# EAGLE board STM32EDUv1p0 (EAGLE 5.10), part 1 of 2
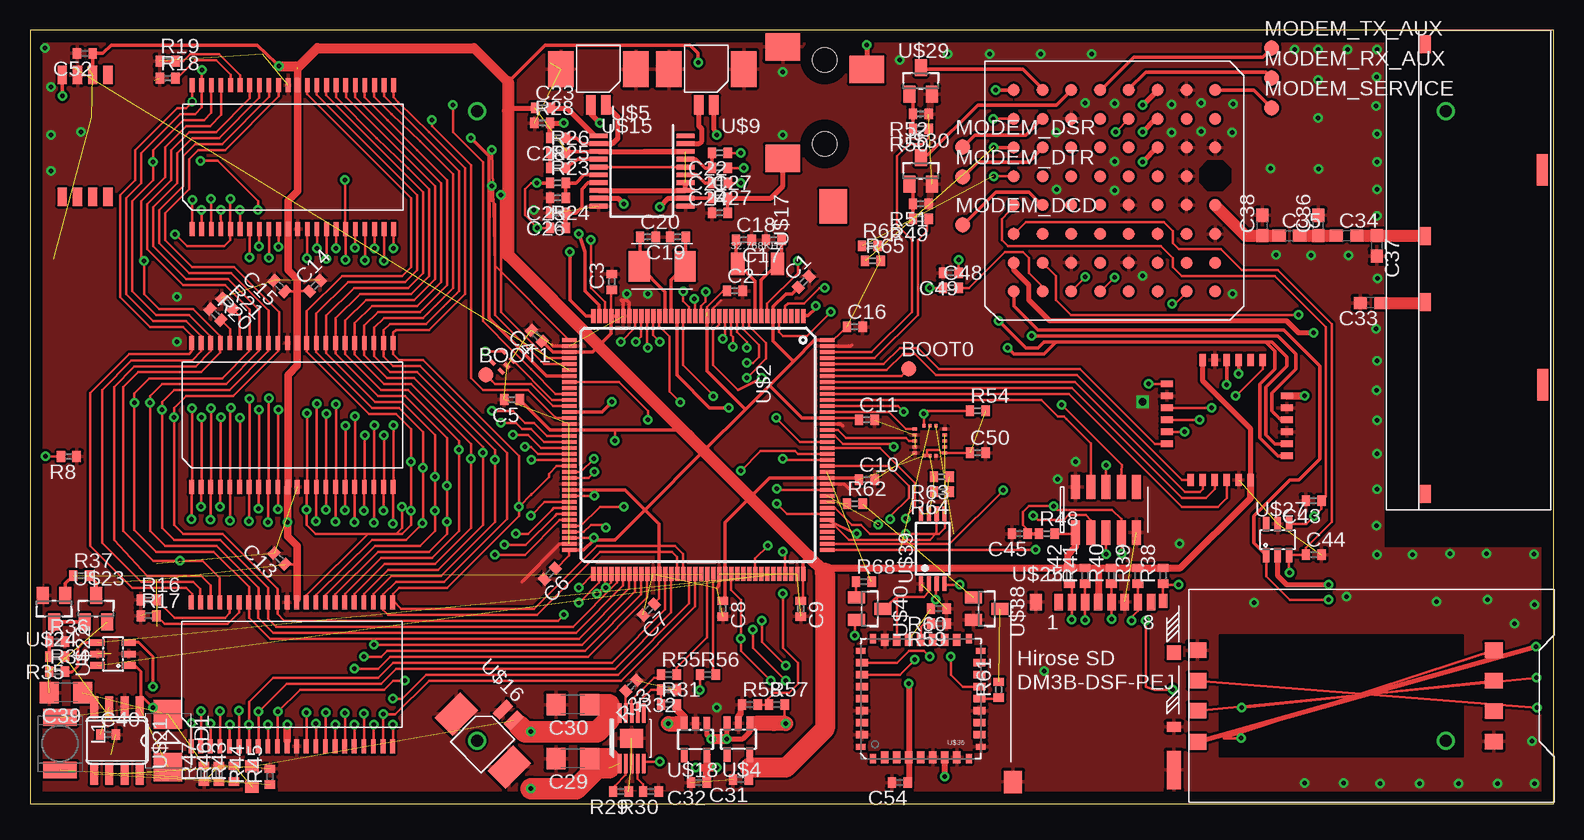
[diagram p4: board, top side]
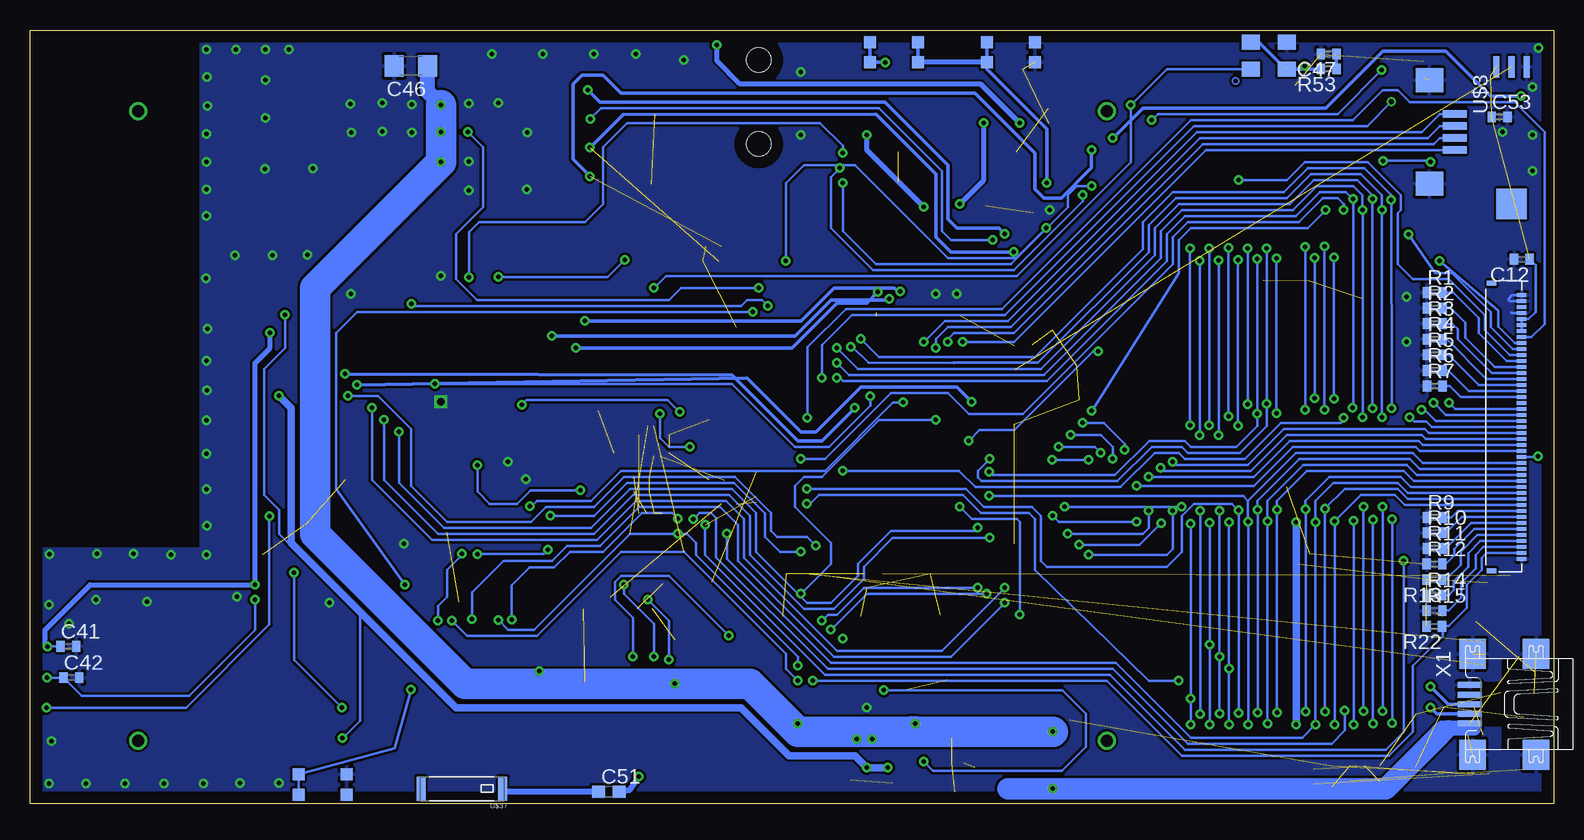
[diagram p5: board, bottom side, seen from below]

Size 127 x 64.5 mm. Coordinates in mm from the lower left corner, seen from the top.
Outline: 0,0 127,0 127,64.5 0,64.5 0,0
Copper layers (1*16): Top 0.035mm / dielectric 1.5mm / Bottom 0.035mm
Design rules "default": minimum track width 10mil, minimum drill 24mil, track to track 8mil, track to pad 8mil, pad to pad 8mil, via to via 8mil, smd to smd 8mil, copper to edge 40mil, drill to drill 8mil, minimum pad ring 10mil, minimum via ring 8mil, stop-mask expansion 4mil, vias tented up to drill 0mil, thermal gap 10mil

## Footprints (pad centres in the part's own frame; a part is rotated, then mirrored left to right if it is on the bottom)
B1,27 = smd 1.27 x 1.27: TP 0,0
C0402 = smd 0.7 x 0.9: 1 -0.65,0; 2 0.65,0
C1206 = smd 1.6 x 1.8: 1 -1.4,0; 2 1.4,0
C0603 = smd 1.1 x 1: 1 -0.85,0; 2 0.85,0
SMB = smd 2.4 x 2.4: A 2.2,0; C -2.2,0
L5038P = smd 1.4 x 2.8: 1 -2.2,0; 2 2.2,0
R0402 = smd 0.7 x 0.9: 1 -0.65,0; 2 0.65,0
R0603 = smd 1 x 1.1: 1 -0.85,0; 2 0.85,0
CM415 = smd 1.1 x 1.9: P$1 0,0; P$2 3.3,0
ABM3 = smd 1.778 x 2.54: P$1 -1.905,0; P$2 1.905,0
TCM8240MD = smd 0.55 x 1: P$1 2,0; P$2 3,0; P$3 4,0; P$4 5,0; P$5 6,0; P$6 7,0; P$13 8,10; P$14 7,10; P$15 6,10; P$16 5,10; P$17 4,10; P$18 3,10 | smd 1 x 0.55: P$7 10,2; P$8 10,3; P$9 10,4; P$10 10,5; P$11 10,6; P$12 10,7; P$19 0,8; P$20 0,7; P$21 0,6; P$22 0,5; P$23 0,4; P$24 0,3
PQFP144 = smd 1.2 x 0.35: 1 -10.75,8.75; 2 -10.75,8.25; 3 -10.75,7.75; 4 -10.75,7.25; 5 -10.75,6.75; 6 -10.75,6.25; 7 -10.75,5.75; 8 -10.75,5.25; 9 -10.75,4.75; 10 -10.75,4.25; 11 -10.75,3.75; 12 -10.75,3.25; 13 -10.75,2.75; 14 -10.75,2.25; 15 -10.75,1.75; 16 -10.75,1.25; 17 -10.75,0.75; 18 -10.75,0.25; 19 -10.75,-0.25; 20 -10.75,-0.75; 21 -10.75,-1.25; 22 -10.75,-1.75; 23 -10.75,-2.25; 24 -10.75,-2.75; 25 -10.75,-3.25; 26 -10.75,-3.75; 27 -10.75,-4.25; 28 -10.75,-4.75; 29 -10.75,-5.25; 30 -10.75,-5.75; 31 -10.75,-6.25; 32 -10.75,-6.75; 33 -10.75,-7.25; 34 -10.75,-7.75; 35 -10.75,-8.25; 36 -10.75,-8.75; 73 10.75,-8.75; 74 10.75,-8.25; 75 10.75,-7.75; 76 10.75,-7.25; 77 10.75,-6.75; 78 10.75,-6.25; 79 10.75,-5.75; 80 10.75,-5.25; 81 10.75,-4.75; 82 10.75,-4.25; 83 10.75,-3.75; 84 10.75,-3.25; 85 10.75,-2.75; 86 10.75,-2.25; 87 10.75,-1.75; 88 10.75,-1.25; 89 10.75,-0.75; 90 10.75,-0.25; 91 10.75,0.25; 92 10.75,0.75; 93 10.75,1.25; 94 10.75,1.75; 95 10.75,2.25; 96 10.75,2.75; 97 10.75,3.25; 98 10.75,3.75; 99 10.75,4.25; 100 10.75,4.75; 101 10.75,5.25; 102 10.75,5.75; 103 10.75,6.25; 104 10.75,6.75; 105 10.75,7.25; 106 10.75,7.75; 107 10.75,8.25; 108 10.75,8.75 | smd 0.35 x 1.2: 37 -8.75,-10.75; 38 -8.25,-10.75; 39 -7.75,-10.75; 40 -7.25,-10.75; 41 -6.75,-10.75; 42 -6.25,-10.75; 43 -5.75,-10.75; 44 -5.25,-10.75; 45 -4.75,-10.75; 46 -4.25,-10.75; 47 -3.75,-10.75; 48 -3.25,-10.75; 49 -2.75,-10.75; 50 -2.25,-10.75; 51 -1.75,-10.75; 52 -1.25,-10.75; 53 -0.75,-10.75; 54 -0.25,-10.75; 55 0.25,-10.75; 56 0.75,-10.75; 57 1.25,-10.75; 58 1.75,-10.75; 59 2.25,-10.75; 60 2.75,-10.75; 61 3.25,-10.75; 62 3.75,-10.75; 63 4.25,-10.75; 64 4.75,-10.75; 65 5.25,-10.75; 66 5.75,-10.75; 67 6.25,-10.75; 68 6.75,-10.75; 69 7.25,-10.75; 70 7.75,-10.75; 71 8.25,-10.75; 72 8.75,-10.75; 109 8.75,10.75; 110 8.25,10.75; 111 7.75,10.75; 112 7.25,10.75; 113 6.75,10.75; 114 6.25,10.75; 115 5.75,10.75; 116 5.25,10.75; 117 4.75,10.75; 118 4.25,10.75; 119 3.75,10.75; 120 3.25,10.75; 121 2.75,10.75; 122 2.25,10.75; 123 1.75,10.75; 124 1.25,10.75; 125 0.75,10.75; 126 0.25,10.75; 127 -0.25,10.75; 128 -0.75,10.75; 129 -1.25,10.75; 130 -1.75,10.75; 131 -2.25,10.75; 132 -2.75,10.75; 133 -3.25,10.75; 134 -3.75,10.75; 135 -4.25,10.75; 136 -4.75,10.75; 137 -5.25,10.75; 138 -5.75,10.75; 139 -6.25,10.75; 140 -6.75,10.75; 141 -7.25,10.75; 142 -7.75,10.75; 143 -8.25,10.75; 144 -8.75,10.75
MOLEX-1.0-FPC-RA-CONN-4POS = smd 0.6 x 2: P$1 0,1; P$2 1,1; P$3 2,1; P$4 3,1 | smd 2 x 2.3: P$5 -2.8,-1.1; P$6 5.8,-1.1
SOT23-5L = smd 0.55 x 1.2: 1 -0.95,-1.3; 2 0,-1.3; 3 0.95,-1.3; 4 0.95,1.3; 5 -0.95,1.3
SSOP20 = smd 0.4 x 1.5: 1 -2.925,-3.625; 2 -2.275,-3.625; 3 -1.625,-3.625; 4 -0.975,-3.625; 5 -0.325,-3.625; 6 0.325,-3.625; 7 0.975,-3.625; 8 1.625,-3.625; 9 2.275,-3.625; 10 2.925,-3.625; 11 2.925,3.625; 12 2.275,3.625; 13 1.625,3.625; 14 0.975,3.625; 15 0.325,3.625; 16 -0.325,3.625; 17 -0.975,3.625; 18 -1.625,3.625; 19 -2.275,3.625; 20 -2.925,3.625
R-PDSO-G10 = smd 0.3 x 1.6: P$1 0,0; P$2 0.5,0; P$3 1,0; P$4 1.5,0; P$5 2,0; P$6 2,4.2; P$7 1.5,4.2; P$8 1,4.2; P$9 0.5,4.2; P$10 0,4.2 | smd 1.9 x 1.6: P$11 1,2.1
SWITCH_KMS = smd 1 x 1: P$1 0,0; P$2 4,0; P$3 4,1.7; P$4 0,1.7
MOLEX-1.25WTB-RA-CONN = smd 0.8 x 1.6: P$1 0,0; P$2 1.25,0 | smd 2.1 x 3: P$3 -2.5,-3; P$4 3.75,-3
STM32-JTAG-10P = smd 0.762 x 2.032: P$1 0,0; P$2 0,3.81; P$3 1.27,0; P$4 1.27,3.81; P$5 2.54,0; P$6 2.54,3.81; P$7 3.81,0; P$8 3.81,3.81; P$9 5.08,0; P$10 5.08,3.81
HIROSE-FFC-FH19SC-45 = smd 0.3 x 0.8: P1 -11,0; P2 -10.5,0; P3 -10,0; P4 -9.5,0; P5 -9,0; P6 -8.5,0; P7 -8,0; P8 -7.5,0; P9 -7,0; P10 -6.5,0; P11 -6,0; P12 -5.5,0; P13 -5,0; P14 -4.5,0; P15 -4,0; P16 -3.5,0; P17 -3,0; P18 -2.5,0; P19 -2,0; P20 -1.5,0; P21 -1,0; P22 -0.5,0; P23 0,0; P24 0.5,0; P25 1,0; P26 1.5,0; P27 2,0; P28 2.5,0; P29 3,0; P30 3.5,0; P31 4,0; P32 4.5,0; P33 5,0; P34 5.5,0; P35 6,0; P36 6.5,0; P37 7,0; P38 7.5,0; P39 8,0; P40 8.5,0; P41 9,0; P42 9.5,0; P43 10,0; P44 10.5,0; P45 11,0 | smd 0.4 x 0.8: P$46 -12,-2.5; P$47 12,-2.5
TSOPII-44 = smd 0.4 x 1.2: 1 0,0; 2 0.8,0; 3 1.6,0; 4 2.4,0; 5 3.2,0; 6 4,0; 7 4.8,0; 8 5.6,0; 9 6.4,0; 10 7.2,0; 11 8,0; 12 8.8,0; 13 9.6,0; 14 10.4,0; 15 11.2,0; 16 12,0; 17 12.8,0; 18 13.6,0; 19 14.4,0; 20 15.2,0; 21 16,0; 22 16.8,0; 23 16.8,12; 24 16,12; 25 15.2,12; 26 14.4,12; 27 13.6,12; 28 12.8,12; 29 12,12; 30 11.2,12; 31 10.4,12; 32 9.6,12; 33 8.8,12; 34 8,12; 35 7.2,12; 36 6.4,12; 37 5.6,12; 38 4.8,12; 39 4,12; 40 3.2,12; 41 2.4,12; 42 1.6,12; 43 0.8,12; 44 0,12
KOBICONN-161-403X-E-TOP = smd 2.3 x 2.9: P$1 -2.4,3.5; P$2 -11.7,3.5; P$4 -4.3,-3.5 | smd 2.9 x 2.3: P$3 -15.7,-0.7 | hole 2: -3.5,0; -10.5,0
TELIT-GE865 = smd 1 x 1: A1 0,0; A2 0,-2.4; A3 0,-4.8; A4 0,-7.2; A5 0,-9.6; A6 0,-12; A7 0,-14.4; A8 0,-16.8; B1 2.4,0; B2 2.4,-2.4; B3 2.4,-4.8; B4 2.4,-7.2; B5 2.4,-9.6; B6 2.4,-12; B7 2.4,-14.4; B8 2.4,-16.8; C1 4.8,0; C2 4.8,-2.4; C3 4.8,-4.8; C4 4.8,-7.2; C5 4.8,-9.6; C6 4.8,-12; C7 4.8,-14.4; C8 4.8,-16.8; D1 7.2,0; D2 7.2,-2.4; D3 7.2,-4.8; D4 7.2,-7.2; D5 7.2,-9.6; D6 7.2,-12; D7 7.2,-14.4; D8 7.2,-16.8; E1 9.6,0; E2 9.6,-2.4; E3 9.6,-4.8; E4 9.6,-7.2; E5 9.6,-9.6; E6 9.6,-12; E7 9.6,-14.4; E8 9.6,-16.8; F1 12,0; F2 12,-2.4; F3 12,-4.8; F4 12,-7.2; F5 12,-9.6; F6 12,-12; F7 12,-14.4; F8 12,-16.8; G1 14.4,0; G2 14.4,-2.4; G3 14.4,-4.8; G4 14.4,-7.2; G5 14.4,-9.6; G6 14.4,-12; G7 14.4,-14.4; G8 14.4,-16.8; H1 16.8,0; H2 16.8,-2.4; H3 16.8,-4.8; H5 16.8,-9.6; H6 16.8,-12; H7 16.8,-14.4; H8 16.8,-16.8
CCM03-300X = smd 1.5 x 1.3: C1 24.7,5.1; C2 24.7,2.5; C3 24.7,0; C5 0,5.08; C6 0,2.54; C7 0,0; P$1 0,-2.54; P$2 24.705,-2.54
SO08 = smd 0.66 x 1.8: 1 -1.905,-2.773; 2 -0.635,-2.773; 3 0.635,-2.773; 4 1.905,-2.773; 5 1.905,2.773; 6 0.635,2.773; 7 -0.635,2.773; 8 -1.905,2.773
SOT23-6L = smd 0.55 x 1.2: 1 -0.95,-1.3; 2 0,-1.3; 3 0.95,-1.3; 4 0.95,1.3; 5 0,1.3; 6 -0.95,1.3
SOT23 = smd 1 x 1.4: 1 -0.95,-1.1; 2 0.95,-1.1; 3 0,1.1
HIROSE-SDCARD-DM3B-DSF-PEJ = smd 0.7 x 1.4: P$1 0,-0.7; P$2 1.1,-0.7; P$3 2.2,-0.7; P$4 3.3,-0.7; P$5 4.4,-0.7; P$6 5.5,-0.7; P$7 6.6,-0.7; P$8 7.7,-0.7 | smd 0.7 x 1.2: P$9 8.7,-0.6 | smd 1.2 x 1.2: P$10 9.6,-4.9 | smd 1.2 x 0.8: P$11 9.6,-11.1 | smd 1.2 x 3.2: P$12 9.6,-14.7 | smd 1.5 x 1.9: P$13 -3.8,-15.7 | smd 1 x 1.4: P$14 -1.9,-0.7
REFLEXUS-A10315 = smd 1.5 x 1: P$1 17.2,-0.5; P$2 22.7,-0.5; P$3 1.2,-0.5; P$4 38.7,-0.5 | smd 2.6 x 0.9: P$5 11.66,9.32; P$6 29.58,9.35
SP0408HE5H-BOT = smd 1.25 x 1.5 bottom: P$1 2.25,3; P$2 2.25,0; P$3 0,0; P$4 0,3
LIS331DLH = smd 0.4 x 0.25: P$1 -1.25,1; P$2 -1.25,0.5; P$3 -1.25,0; P$4 -1.25,-0.5; P$5 -1.25,-1; P$9 1.25,-1; P$10 1.25,-0.5; P$11 1.25,0; P$12 1.25,0.5; P$13 1.25,1 | smd 0.25 x 0.33: P$6 -0.5,-1.25; P$7 0,-1.25; P$8 0.5,-1.25; P$14 0.5,1.25; P$15 0,1.25; P$16 -0.5,1.25
SC-70-5 = smd 0.3 x 0.6: P$1 -0.65,0; P$2 0,0; P$3 0.65,0; P$4 0.65,1.056; P$5 -0.65,1.056
HIH-5030 = smd 2.54 x 2.54: P$1 0,0 | smd 0.508 x 1.778: P$2 -1.27,-11.43; P$3 0,-11.43; P$4 1.27,-11.43
SSOP8 = smd 1.524 x 0.762: P$1 0,0; P$2 0,-1.27; P$3 0,-2.54; P$4 0,-3.81; P$5 10.16,-3.81; P$6 10.16,-2.54; P$7 10.16,-1.27; P$8 10.16,0
GR-10 = smd 0.8 x 0.5: 1 5,4; 9 5,-4; 19 -5,-4; 27 -5,4 | smd 1 x 0.6: 2 4.9,3; 3 4.9,2; 4 4.9,1; 5 4.9,0; 6 4.9,-1; 7 4.9,-2; 8 4.9,-3; 20 -4.9,-3; 21 -4.9,-2; 22 -4.9,-1; 23 -4.9,0; 24 -4.9,1; 25 -4.9,2; 26 -4.9,3 | smd 0.5 x 0.8: 10 4,-5; 18 -4,-5; 28 -4,5; 36 4,5 | smd 0.6 x 1: 11 3,-4.9; 12 2,-4.9; 13 1,-4.9; 14 0,-4.9; 15 -1,-4.9; 16 -2,-4.9; 17 -3,-4.9; 29 -3,4.9; 30 -2,4.9; 31 -1,4.9; 32 0,4.9; 33 1,4.9; 34 2,4.9; 35 3,4.9
ANTENNA-CHIP6 = smd 0.75 x 2: 1 -3.4,0; NC 3.4,0
TSSOP8 = smd 1.2 x 0.35: 1 -2.925,0.975; 2 -2.925,0.325; 3 -2.925,-0.325; 4 -2.925,-0.975; 5 2.925,-0.975; 6 2.925,-0.325; 7 2.925,0.325; 8 2.925,0.975
UX60A-MB-5ST = smd 2 x 0.5: 1 2.25,1.6; 2 2.25,0.8; 3 2.25,0; 4 2.25,-0.8; 5 2.25,-1.6 | smd 2.2 x 2.5: M1 -3.3,-4.2; M2 -3.3,4.2; M3 2,4.2; M4 2,-4.2

## Placement (x,y rotation side)
BOOT0  TPB1,27  [B1,27]  73.25,36.25 0 top
BOOT1  TPB1,27  [B1,27]  38,35.75 0 top
C1  [C0402]  64.5,43.5 45 top
C2  [C0402]  58.75,42.75 0 top
C3  [C0402]  48.5,43.5 90 top
C4  [C0402]  42.25,39 135 top
C5  [C0402]  40.18,33.68 180 top
C6  [C0402]  43.32,19.18 225 top
C7  [C0402]  51.57,16.18 225 top
C8  [C0402]  57.75,16.25 270 top
C9  [C0402]  64.25,16.25 270 top
C10  [C0402]  69.75,27 0 top
C11  [C0402]  69.75,32 0 top
C12  0.1uF  [C0402]  2.64,45.39 180 bottom
C13  0.1uF  [C0402]  20.8,20.41 135 top
C14  0.1uF  [C0402]  23.74,43.17 45 top
C15  0.1uF  [C0402]  20.8,43.15 135 top
C16  [C0402]  68.75,39.75 0 top
C17  9pF  [C0402]  62,47 180 top
C18  9pF  [C0402]  59.5,47 0 top
C19  18pF  [C0402]  54,47.25 180 top
C20  18pF  [C0402]  51.5,47.25 0 top
C21  0.33uF  [C0402]  57.5,53 180 top
C22  0.33uF  [C0402]  57.5,54.25 180 top
C23  0.1uF  [C0402]  42.75,58 0 top
C24  0.33uF  [C0402]  57.5,51.75 180 top
C25  [C0402]  44,50.5 180 top
C26  [C0402]  44,49.25 180 top
C27  [C0402]  57.5,50.5 0 top
C28  [C0402]  44,55.5 180 top
C29  [C1206]  45.25,3.75 180 top
C30  [C1206]  45.25,8.25 180 top
C31  [C0402]  59.25,2 180 top
C32  [C0402]  55.75,1.75 180 top
C33  [C0603]  111.75,41.75 180 top
C34  [C0603]  109.75,47.35 0 top
C35  [C0603]  104.97,47.35 0 top
C36  [C0603]  107.4,48.2 90 top
C37  [C0603]  112.25,46.5 270 top
C38  [C0603]  102.72,48.2 90 top
C39  [C1206]  3,9.25 180 top
C40  680pF  [C0402]  6.5,5.75 0 top
C41  [C0402]  123.8,13.1 0 bottom
C42  [C0402]  123.55,10.5 0 bottom
C43  [C0402]  107,25.25 180 top
C44  [C0402]  107,20.75 0 top
C45  220pF  [C0402]  82.5,22.5 180 top
C46  22uF  [C1206]  95.25,61.5 180 bottom
C47  0.47uF  [C0402]  18.75,62.5 180 bottom
C48  0.1uF  [C0402]  76.75,43 0 top
C49  0.1uF  [C0402]  76.75,44.25 180 top
C50  0.1uF  [C0402]  79,29.25 0 top
C51  0.033uF  [C0603]  78.75,1 0 bottom
C52  0.1uF  [C0402]  4.58,62.55 180 top
C53  0.1uF  [C0402]  4.5,57.25 0 bottom
C54  0.1uF  [C0402]  72.5,1.75 180 top
D1  MBRS130LT3  [SMB]  11.5,5.25 270 top
L1  120uH  [L5038P]  2.5,5 270 top
MODEM_DCD  TPB1,27  [B1,27]  77.75,48.25 0 top
MODEM_DSR  TPB1,27  [B1,27]  77.75,54.75 0 top
MODEM_DTR  TPB1,27  [B1,27]  77.75,52.25 0 top
MODEM_RX_AUX  TPB1,27  [B1,27]  103.5,60.5 0 top
MODEM_SERVICE  TPB1,27  [B1,27]  103.5,58 0 top
MODEM_TX_AUX  TPB1,27  [B1,27]  103.5,63 0 top
R1  10K  [R0402]  9.9,42.61 0 bottom
R2  10K  [R0402]  9.9,41.31 0 bottom
R3  10K  [R0402]  9.89,40.01 0 bottom
R4  10K  [R0402]  9.89,38.71 0 bottom
R5  10K  [R0402]  9.91,37.41 0 bottom
R6  10K  [R0402]  9.9,36.11 0 bottom
R7  10K  [R0402]  9.9,34.81 0 bottom
R8  10K  [R0402]  3.23,28.94 180 top
R9  10K  [R0402]  9.89,23.86 0 bottom
R10  10K  [R0402]  9.91,22.58 0 bottom
R11  10K  [R0402]  9.91,21.28 0 bottom
R12  [R0402]  9.93,19.97 0 bottom
R13  10K  [R0402]  9.92,18.67 180 bottom
R14  10K  [R0402]  9.93,17.38 0 bottom
R15  10K  [R0402]  9.92,16.08 0 bottom
R16  10K  [R0402]  9.89,16.98 0 top
R17  10K  [R0402]  9.88,15.66 0 top
R18  10K  [R0402]  11.48,60.48 0 top
R19  10K  [R0402]  11.47,61.91 0 top
R20  10K  [R0402]  15.46,40.77 315 top
R21  10K  [R0402]  16.45,41.68 315 top
R22  10K  [R0402]  9.95,14.77 180 bottom
R23  2.2K  [R0402]  44,51.75 0 top
R24  2.2K  [R0402]  44,48 0 top
R25  100K  [R0402]  44,53 0 top
R26  820K  [R0402]  44,54.25 0 top
R27  [R0402]  57.5,49.25 0 top
R28  [R0402]  42.7,56.75 0 top
R29  1K  [R0402]  49.25,1 180 top
R30  1K  [R0402]  51.75,1 180 top
R31  [R0402]  53.25,8.25 0 top
R32  [R0402]  53.25,9.5 180 top
R33  [R0402]  50.12,9.83 225 top
R34  1.5K  [R0402]  2.25,11 0 top
R35  10K  [R0402]  2.25,12.25 180 top
R36  36K  [R0402]  2.25,13.5 0 top
R37  47K  [R0402]  4.25,19 0 top
R38  [R0402]  94.45,19 90 top
R39  [R0402]  92.35,19 90 top
R40  [R0402]  90.15,19 90 top
R41  [R0402]  87.95,19 90 top
R42  [R0402]  86.65,19 90 top
R43  180  [R0402]  17,2.5 90 top
R44  0.24  [R0603]  18.5,2.25 90 top
R45  [R0402]  20,2.25 90 top
R46  2.2K  [R0402]  15.75,2.5 90 top
R47  33.8K  [R0402]  14.5,2.5 90 top
R48  100K  [R0402]  84.75,22.5 0 top
R49  10K  [R0402]  74.25,48.75 180 top
R50  10K  [R0402]  74.25,56.25 180 top
R51  47K  [R0402]  74.25,50 180 top
R52  47K  [R0402]  74.25,57.5 180 top
R53  0  [R0402]  18.75,61.25 180 bottom
R54  47K  [R0402]  79,32.75 0 top
R55  330  [R0402]  53.25,10.75 0 top
R56  330  [R0402]  56.5,10.75 0 top
R57  [R0402]  62.25,8.25 0 top
R58  [R0402]  60,8.25 0 top
R59  47K  [R0402]  75.75,15 180 top
R60  47K  [R0402]  75.75,16.25 180 top
R61  10K  [R0402]  80.75,9.5 90 top
R62  10K  [R0402]  68.75,25 0 top
R63  [R0402]  76,27.25 180 top
R64  [R0402]  76,26 180 top
R65  [R0402]  70.25,45.25 0 top
R66  [R0402]  70,46.5 0 top
R68  [R0402]  69.5,18.5 0 top
U3  CM415  [CM415]  59,45 0 top
U5  CRYSTAL-ABM3  [ABM3]  52.7,44.8 180 top
U$1  TCM8240MD  [TCM8240MD]  94.75,27 0 top
U$2  STM32F103XE  [PQFP144]  55.7,29.9 270 top
U$3  MOLEX-1.0-FPC-RA-CONN-4POS  [MOLEX-1.0-FPC-RA-CONN-4POS]  9.25,57.5 270 bottom
U$4  NCP500  [SOT23-5L]  59.05,5.37 180 top
U$5  TDA8552TS  [SSOP20]  51,52.75 270 top
U$6  BQ24090  [R-PDSO-G10]  49.15,3.34 0 top
U$7  SWITCH-KSC  [SWITCH_KMS]  43.25,63.5 180 bottom
U$8  SWITCH-KSC  [SWITCH_KMS]  53,63.5 180 bottom
U$9  MOLEX-1.25-WTB-RA-CONN-2POS  [MOLEX-1.25WTB-RA-CONN]  57,58.25 180 top
U$10  STM32-JTAG-10P  [STM32-JTAG-10P]  87.16,22.59 0 top
U$11  DISPLAYTECH-SDT033TFTH  [HIROSE-FFC-FH19SC-45]  2.66,31.4 270 bottom
U$12  CY62157EV30LL-55ZSXE  [TSOPII-44]  13.43,4.77 0 top
U$13  CY62157EV30LL-55ZSXE  [TSOPII-44]  13.52,47.9 0 top
U$14  CY62157EV30LL-55ZSXE  [TSOPII-44]  13.47,26.4 0 top
U$15  MOLEX-1.25-WTB-RA-CONN-2POS  [MOLEX-1.25WTB-RA-CONN]  48,58.25 180 top
U$16  MOLEX-1.25-WTB-RA-CONN-2POS  [MOLEX-1.25WTB-RA-CONN]  39.43,7.82 315 top
U$17  KOBICONN-161-4034-E-TOP  [KOBICONN-161-403X-E-TOP]  66.25,65.5 90 top
U$18  NCP500  [SOT23-5L]  55.48,5.35 180 top
U$19  TELIT-GE865T  [TELIT-GE865]  82,59.5 0 top
U$20  CCM03-3009  [CCM03-300X]  122,10.25 180 top
U$21  DIODESINC-AP34063  [SO08]  7.25,5.25 180 top
U$22  USBLC6-2  [SOT23-6L]  6.93,12.47 90 top
U$23  PMBT6428  [SOT23]  5.5,16.25 0 top
U$24  PMBT6428  [SOT23]  2,16.25 180 top
U$25  HIROSE-SDCARD-DM3B-DSF-PEJ  [HIROSE-SDCARD-DM3B-DSF-PEJ]  85.75,17.5 0 top
U$26  REFLEXUS-A10315  [REFLEXUS-A10315]  116.75,64.5 270 top
U$27  DALC208  [SOT23-6L]  104,22 0 top
U$28  SPM0408HE5H  [SP0408HE5H-BOT]  22.25,63.5 270 top
U$29  PMBT6428  [SOT23]  74.25,60.25 0 top
U$30  PMBT6428  [SOT23]  74.25,52.75 0 top
U$31  SWITCH-KSC  [SWITCH_KMS]  104.62,0.73 0 bottom
U$32  LIS331DLH  [LIS331DLH]  75,30.25 180 top
U$33  MCP9700A  [SC-70-5]  39.75,36.5 45 top
U$34  HIH-5030  [HIH-5030]  3.5,50 180 bottom
U$35  MP3H6115A  [SSOP8]  6.5,60.75 270 top
U$36  MN5010HS  [GR-10]  74.25,8.75 180 top
U$37  ANTENNA2SMD6  [ANTENNA-CHIP6]  91,1.25 180 bottom
U$38  PMBT6428  [SOT23]  79.75,16.25 270 top
U$39  NXP-GTL2002  [TSSOP8]  75.25,21.25 90 top
U$40  BIPLOAR-MMBTA92  [SOT23]  70,16.25 270 top
X1  MINI-USB-UX60A-MB-5ST  [UX60A-MB-5ST]  4.75,8.28 180 bottom